# EAGLE schematic ap_kit (EAGLE 5.07)

## Sheet 1 of 2
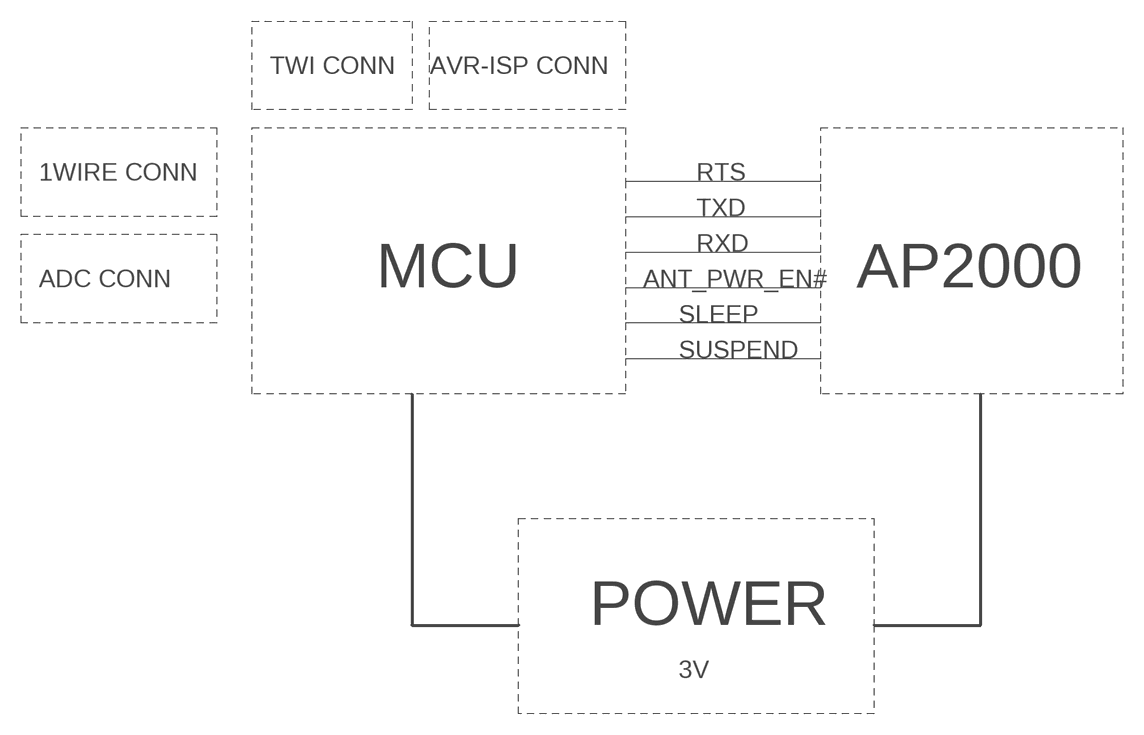
[diagram p0: schematic, sheet 1]

### Notes on the sheet
- TWI CONN | AVR-ISP CONN
- 1WIRE CONN | RTS
- TXD
- RXD
- ADC CONN | MCU | ANT_PWR_EN# | AP2000
- SLEEP
- SUSPEND
- POWER
- 3V

## Sheet 2 of 2
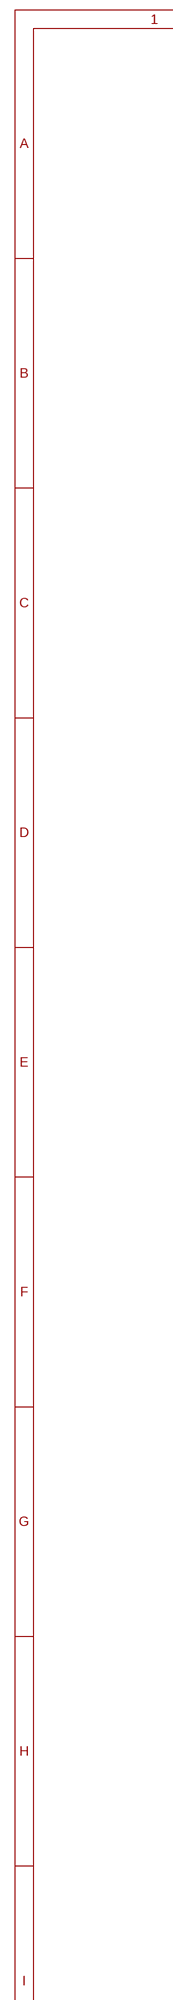
[diagram p1: schematic, sheet 2, part 1 of 2]
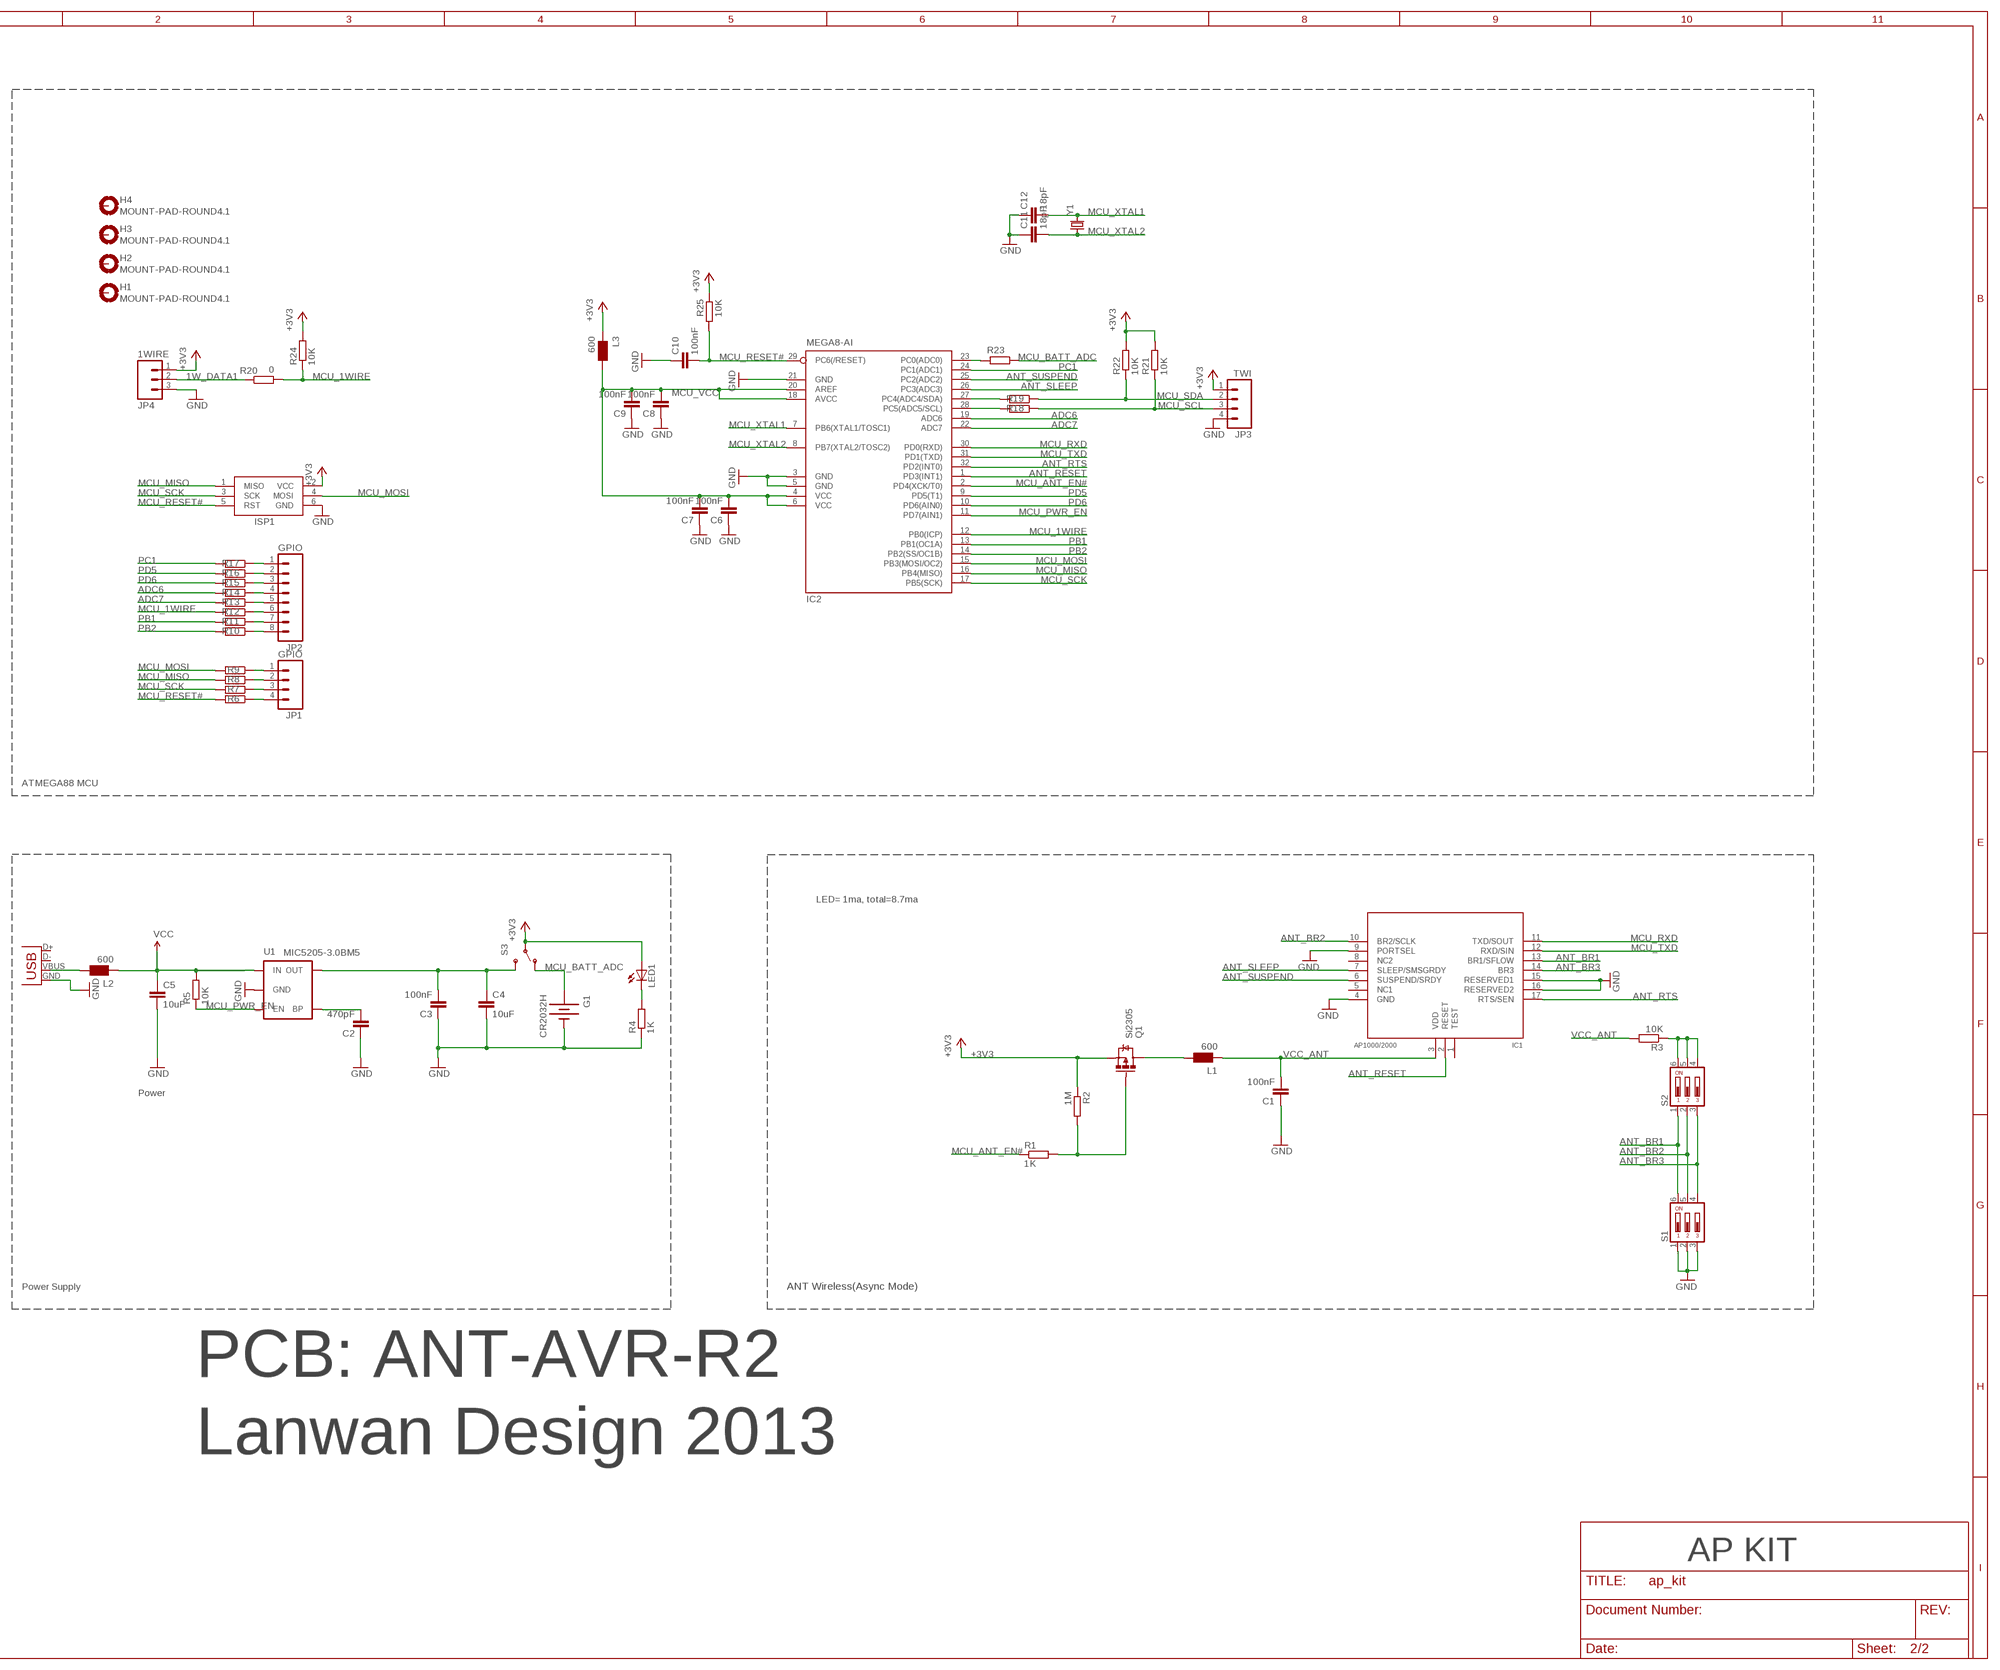
[diagram p2: schematic, sheet 2, part 2 of 2]

### Parts
C1  100nF  C-EUC0603  [C0603]
C2  470pF  C-EUC0603  [C0603]
C3  100nF  C-EUC0603  [C0603]
C4  10uF  C-EUC0805  [C0805]
C5  10uF  C-EUC0805  [C0805]
C6  100nF  C-EUC0603  [C0603]
C7  100nF  C-EUC0603  [C0603]
C8  100nF  C-EUC0603  [C0603]
C9  100nF  C-EUC0603  [C0603]
C10  100nF  C-EUC0603  [C0603]
C11  18pF  C-EUC0603  [C0603]
C12  18pF  C-EUC0603  [C0603]
G1  CR2032H  BATTERY20PTH  [BATTCOM_20MM_PTH]
H1  MOUNT-PAD-ROUND4.1  [4,1-PAD]
H2  MOUNT-PAD-ROUND4.1  [4,1-PAD]
H3  MOUNT-PAD-ROUND4.1  [4,1-PAD]
H4  MOUNT-PAD-ROUND4.1  [4,1-PAD]
IC1  AP1000/2000  AP1000AP  [AP1000]
IC2  MEGA8-AI  [TQFP32-08]
ISP1  AVRISP-6  [AVRISP]
JP1  GPIO  M04LONGPADS  [1X04_LONGPADS]
JP2  GPIO  M08LONGPADS  [1X08_LONGPADS]
JP3  TWI  M04LONGPADS  [1X04_LONGPADS]
JP4  1WIRE  M03LONGPADS  [1X03_LONGPADS]
L1  600  WE-CBF_1206  [1206]
L2  600  WE-CBF_1206  [1206]
L3  600  WE-CBF_1206  [1206]
LED1  LED0603  [LED-0603]
Q1  Si2305  MOSFET-PCHANNELSMD  [SOT23-3]
R1  1K  R-EU_R0603  [R0603]
R2  1M  R-EU_R0603  [R0603]
R3  10K  R-EU_R0603  [R0603]
R4  1K  R-EU_R0603  [R0603]
R5  10K  R-EU_R0603  [R0603]
R6  0  R-EU_R0603  [R0603]
R7  0  R-EU_R0603  [R0603]
R8  0  R-EU_R0603  [R0603]
R9  0  R-EU_R0603  [R0603]
R10  0  R-EU_R0603  [R0603]
R11  0  R-EU_R0603  [R0603]
R12  0  R-EU_R0603  [R0603]
R13  0  R-EU_R0603  [R0603]
R14  0  R-EU_R0603  [R0603]
R15  0  R-EU_R0603  [R0603]
R16  0  R-EU_R0603  [R0603]
R17  0  R-EU_R0603  [R0603]
R18  22  R-EU_R0603  [R0603]
R19  22  R-EU_R0603  [R0603]
R20  0  R-EU_R0603  [R0603]
R21  10K  R-EU_R0603  [R0603]
R22  10K  R-EU_R0603  [R0603]
R23  1M  R-EU_R0603  [R0603]
R24  10K  R-EU_R0603  [R0603]
R25  10K  R-EU_R0603  [R0603]
S1  DS03  [DS-03]
S2  DS03  [DS-03]
S3  SWITCH-SPSTSMD  [AYZ0202]
U1  MIC5205-3.0BM5  V_REG_LDOSMD  [SOT23-5]
X1  USB-SMD-NS  [USB-MINIB-NOSTOP]
Y1  CRYSTALHC49US  [HC49US]

### Nets
1W_DATA1: JP4.2 R20.1
+3V3: ISP1.2(VCC) JP3.1 JP4.1 L3.1 LED1.A Q1.2(S) R2.1 R21.2 R22.2 R24.2 R25.2 S3.2(P)
ADC6: IC2.19(ADC6) R14.2
ADC7: IC2.22(ADC7) R13.2
ANT_BR1: IC1.13(BR1/SFLOW) S1.6 S2.1
ANT_BR2: IC1.10(BR2/SCLK) S1.5 S2.2
ANT_BR3: IC1.14(BR3) S1.4 S2.3
ANT_RESET: IC1.2(RESET) IC2.1(PD3(INT1))
ANT_RTS: IC1.17(RTS/SEN) IC2.32(PD2(INT0))
ANT_SLEEP: IC1.7(SLEEP/SMSGRDY) IC2.26(PC3(ADC3))
ANT_SUSPEND: IC1.6(SUSPEND/SRDY) IC2.25(PC2(ADC2))
GND: C1.1 C2.1 C3.1 C4.2 C5.2 C6.1 C7.1 C8.1 C9.1 C10.1 C11.1 C12.1 G1.2(-) IC1.4(GND) IC1.9(PORTSEL) IC1.15(RESERVED1) IC1.16(RESERVED2) IC2.3(GND) IC2.5(GND) IC2.21(GND) ISP1.6(GND) JP3.4 JP4.3 R4.1 S1.1 S1.2 S1.3 U1.2(GND) X1.GND
MCU_1WIRE: IC2.12(PB0(ICP)) R12.2 R20.2 R24.1
MCU_ANT_EN#: IC2.2(PD4(XCK/T0)) R1.1
MCU_BATT_ADC: G1.1(+) R23.1 S3.1(O)
MCU_MISO: IC2.16(PB4(MISO)) ISP1.1(MISO) R8.2
MCU_MOSI: IC2.15(PB3(MOSI/OC2)) ISP1.4(MOSI) R9.2
MCU_PWR_EN: IC2.11(PD7(AIN1)) R5.1 U1.3(EN)
MCU_RESET#: C10.2 IC2.29(PC6(/RESET)) ISP1.5(RST) R6.2 R25.1
MCU_RXD: IC1.11(TXD/SOUT) IC2.30(PD0(RXD))
MCU_SCK: IC2.17(PB5(SCK)) ISP1.3(SCK) R7.2
MCU_SCL: JP3.3 R18.1 R21.1
MCU_SDA: JP3.2 R19.1 R22.1
MCU_TXD: IC1.12(RXD/SIN) IC2.31(PD1(TXD))
MCU_VCC: C6.2 C7.2 C8.2 C9.2 IC2.4(VCC) IC2.6(VCC) IC2.18(AVCC) IC2.20(AREF) L3.2
MCU_XTAL1: C12.2 IC2.7(PB6(XTAL1/TOSC1)) Y1.2
MCU_XTAL2: C11.2 IC2.8(PB7(XTAL2/TOSC2)) Y1.1
N$2: R3.1 S2.4 S2.5 S2.6
N$3: IC2.23(PC0(ADC0)) R23.2
N$4: C2.2 U1.4(BP)
N$5: C3.2 C4.1 S3.3(S) U1.5(OUT)
N$6: LED1.C R4.2
N$8: L1.2 Q1.3(D)
N$9: L2.2 X1.VBUS
N$14: IC2.27(PC4(ADC4/SDA)) R19.2
N$15: IC2.28(PC5(ADC5/SCL)) R18.2
N$21: JP2.1 R17.1
N$22: JP2.2 R16.1
N$23: JP2.3 R15.1
N$24: JP2.4 R14.1
N$25: JP2.5 R13.1
N$26: JP2.6 R12.1
N$27: JP2.7 R11.1
N$29: JP2.8 R10.1
N$30: JP1.1 R9.1
N$31: JP1.2 R8.1
N$32: JP1.3 R7.1
N$33: JP1.4 R6.1
N$34: Q1.1(G) R1.2 R2.2
PB1: IC2.13(PB1(OC1A)) R11.2
PB2: IC2.14(PB2(SS/OC1B)) R10.2
PC1: IC2.24(PC1(ADC1)) R17.2
PD5: IC2.9(PD5(T1)) R16.2
PD6: IC2.10(PD6(AIN0)) R15.2
VCC: C5.1 L2.1 R5.2 U1.1(IN)
VCC_ANT: C1.2 IC1.3(VDD) L1.1 R3.2
Unconnected: H1.B4,1(MOUNT) H2.B4,1(MOUNT) H3.B4,1(MOUNT) H4.B4,1(MOUNT) IC1.1(TEST) IC1.5(NC1) IC1.8(NC2) X1.D+ X1.D-

### Notes on the sheet
- ATMEGA88 MCU
- LED= 1ma, total=8.7ma
- Power
- Power Supply | ANT Wireless(Async Mode)
- PCB: ANT-AVR-R2
- Lanwan Design 2013
- AP KIT

## Library data of the parts
C1-C12 = resistor:C-EU: CAPACITOR, European symbol
G1 = Lanwan2:BATTERY: Battery Holders Various common sizes : AA, AAA, 20mm coin cell and 12mm coin cell.
H1-H4 = holes:MOUNT-PAD-ROUND: MOUNTING PAD, round
IC1 = Lanwan2:AP1000: AP1000/AP2000 nRF24AP2 ANT+ Noridic
IC2 = atmel:MEGA8: MICROCONTROLLER 8 Kbytes FLASH, 1 kbytes SRAM, 512 bytes EEPROM, USART, 6-channel 10 bit ADC, 2-channel 8 bit ADC Pin compatible with Atmega48, ATMega88, ATMega168 Source: avr.lbr
ISP1 = adafruit:AVRISP: AVR ISP HEADER Standard 6 pin header for AVR programming
JP1 JP3 = Lanwan2:M04: Header 4 Standard 4-pin 0.1" header. Use with straight break away headers (SKU : PRT-00116), right angle break away headers (PRT-00553), swiss pins (PRT-00743), machine pins (PRT-00117), and female headers (PRT-00115). Molex polarized connector foot print use with SKU : PRT-08231 with associated crimp pins and housings. 1MM SMD Version SKU: PRT-10208
JP2 = Lanwan2:M08: Header 8 Standard 8-pin 0.1" header. Use with straight break away headers (SKU : PRT-00116), right angle break away headers (PRT-00553), swiss pins (PRT-00743), machine pins (PRT-00117), and female headers (PRT-00115).
JP4 = Lanwan2:M03: Header 3 Standard 3-pin 0.1" header. Use with straight break away headers (SKU : PRT-00116), right angle break away headers (PRT-00553), swiss pins (PRT-00743), machine pins (PRT-00117), and female headers (PRT-00115). Molex polarized connector foot print use with SKU : PRT-08232 with associated crimp pins and housings.
L1-L3 = wuerth-elektronik:WE-CBF: SMD EMI Suppression Ferrite Beads - excellent anti-EMI properties - low DCR - impedances till 3000 ohms - rated current up to 6 A
LED1 = Lanwan2:LED: LEDs Standard schematic elements and footprints for 5mm, 3mm, 1206, and 0603 sized LEDs. 5mm - Spark Fun Electronics SKU : COM-00529 (and others)
Q1 = SparkFun:MOSFET-PCHANNEL
R1-R25 = resistor:R-EU_: RESISTOR, European symbol
S1 S2 = switch-dil:DS03: DIL/CODE SWITCH
S3 = Lanwan2:SWITCH-SPST: SPST Switch Simple slide switch. Spark Fun Electronics SKU : COM-00102
U1 = SparkFun:V_REG_LDO: Voltage Regulator LDO Standard 150mA LDO voltage regulator in SOT-23 layout. Micrel part MIC5205. BP (by-pass) pin is used to lower output noise with 470pF cap.
X1 = Lanwan2:USB: USB Connectors USB-B-PTH is fully proven SKU : PRT-00139 USB-miniB is fully proven SKU : PRT-00587 USB-A-PCB is untested. USB-A-H is throughly reviewed, but untested. Spark Fun Electronics SKU : PRT-00437 USB-B-SMT is throughly reviewed, but untested. Needs silkscreen touching up. USB-A-S has not been used/tested USB-MB-H has not been used/tested
Y1 = Lanwan2:CRYSTAL: Crystals Various standard crystals. Proven footprints. Spark Fun Electronics SKU : COM-00534